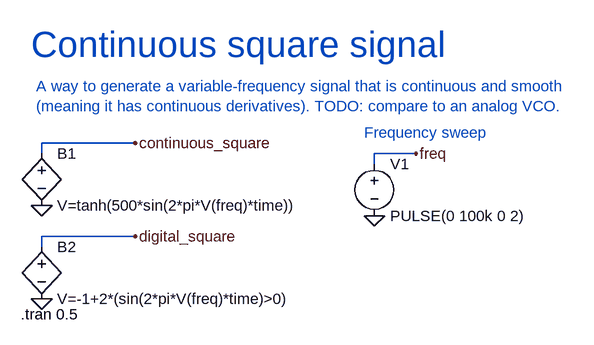
[diagram p0: schematic continuous_square.asc]
continuous_square.asc, the LTspice schematic file:
Version 4
SHEET 1 1112 680
WIRE 336 80 192 80
WIRE 192 96 192 80
WIRE 768 96 704 96
WIRE 704 112 704 96
WIRE 336 224 192 224
WIRE 192 240 192 224
FLAG 192 176 0
FLAG 192 320 0
FLAG 704 192 0
FLAG 768 96 freq
FLAG 336 224 digital_square
FLAG 336 80 continuous_square
SYMBOL bv 192 80 R0
SYMATTR InstName B1
SYMATTR Value V=tanh(500*sin(2*pi*V(freq)*time))
SYMATTR Value2 tripdt={1m/100k}
SYMBOL bv 192 224 R0
SYMATTR InstName B2
SYMATTR Value V=-1+2*(sin(2*pi*V(freq)*time)>0)
SYMATTR Value2 tripdt={1m/100k}
SYMBOL voltage 704 96 R0
WINDOW 123 0 0 Left 0
WINDOW 39 0 0 Left 0
SYMATTR InstName V1
SYMATTR Value PULSE(0 100k 0 2)
TEXT 160 344 Left 2 !.tran 0.5
TEXT 176 -72 Left 5 ;Continuous square signal
TEXT 184 -8 Left 2 ;A way to generate a variable-frequency signal that is continuous and smooth \n(meaning it has continuous derivatives). TODO: compare to an analog VCO.
TEXT 688 64 Left 2 ;Frequency sweep

The netlist it stands for:
* continuous_square.asc
B1 continuous_square 0 V=tanh(500*sin(2*pi*V(freq)*time)) tripdt={1m/100k}
B2 digital_square 0 V=-1+2*(sin(2*pi*V(freq)*time)>0) tripdt={1m/100k}
V1 freq 0 PULSE(0 100k 0 2)
.tran 0.5
* Continuous square signal
* A way to generate a variable-frequency signal that is continuous and smooth
* (meaning it has continuous derivatives). TODO: compare to an analog VCO.
* Frequency sweep
.backanno
.end